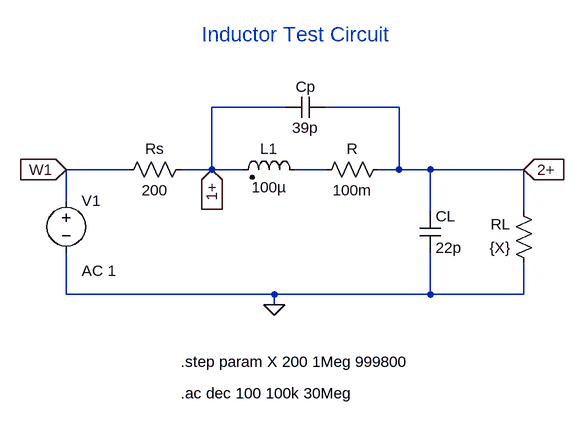
[diagram p0: schematic inductor_test_circuit_ltspice.asc]
inductor_test_circuit_ltspice.asc, the LTspice schematic file:
Version 4
SHEET 1 880 680
WIRE 160 0 48 0
WIRE 336 0 224 0
WIRE -80 96 -176 96
WIRE 48 96 48 0
WIRE 48 96 0 96
WIRE 96 96 48 96
WIRE 224 96 176 96
WIRE 336 96 336 0
WIRE 336 96 304 96
WIRE 384 96 336 96
WIRE 528 96 384 96
WIRE -176 144 -176 96
WIRE 384 160 384 96
WIRE 528 160 528 96
WIRE -176 288 -176 224
WIRE 144 288 -176 288
WIRE 384 288 384 224
WIRE 384 288 144 288
WIRE 528 288 528 240
WIRE 528 288 384 288
WIRE 144 304 144 288
FLAG 144 304 0
FLAG 528 96 2+
IOPIN 528 96 In
FLAG 48 96 1+
IOPIN 48 96 In
FLAG -176 96 W1
IOPIN -176 96 In
SYMBOL res 16 80 R90
WINDOW 0 0 56 VBottom 2
WINDOW 3 32 56 VTop 2
SYMATTR InstName Rs
SYMATTR Value 200
SYMBOL res 544 256 R180
WINDOW 0 36 76 Left 2
WINDOW 3 36 40 Left 2
SYMATTR InstName RL
SYMATTR Value {X}
SYMBOL ind2 192 112 M270
WINDOW 0 32 56 VTop 2
WINDOW 3 4 56 VBottom 2
SYMATTR InstName L1
SYMATTR Value 100µ
SYMATTR Type ind
SYMBOL res 320 80 R90
WINDOW 0 0 56 VBottom 2
WINDOW 3 32 56 VTop 2
SYMATTR InstName R
SYMATTR Value 100m
SYMBOL cap 224 -16 R90
WINDOW 0 0 32 VBottom 2
WINDOW 3 32 32 VTop 2
SYMATTR InstName Cp
SYMATTR Value 39p
SYMBOL voltage -176 128 R0
WINDOW 123 24 124 Left 2
WINDOW 39 0 0 Left 0
SYMATTR Value2 AC 1
SYMATTR InstName V1
SYMATTR Value ""
SYMBOL cap 368 160 R0
SYMATTR InstName CL
SYMATTR Value 22p
TEXT 0 392 Left 2 !.step param X 200 1Meg 999800
TEXT 0 440 Left 2 !.ac dec 100 100k 30Meg
TEXT 32 -112 Left 3 ;Inductor Test Circuit

The netlist it stands for:
* inductor_test_circuit_ltspice.asc
Rs 1+ W1 200
RL 0 2+ {X}
L1 N001 1+ 100µ
R 2+ N001 100m
Cp 2+ 1+ 39p
V1 W1 0 AC 1
CL 2+ 0 22p
.step param X 200 1Meg 999800
.ac dec 100 100k 30Meg
* Inductor Test Circuit
.backanno
.end